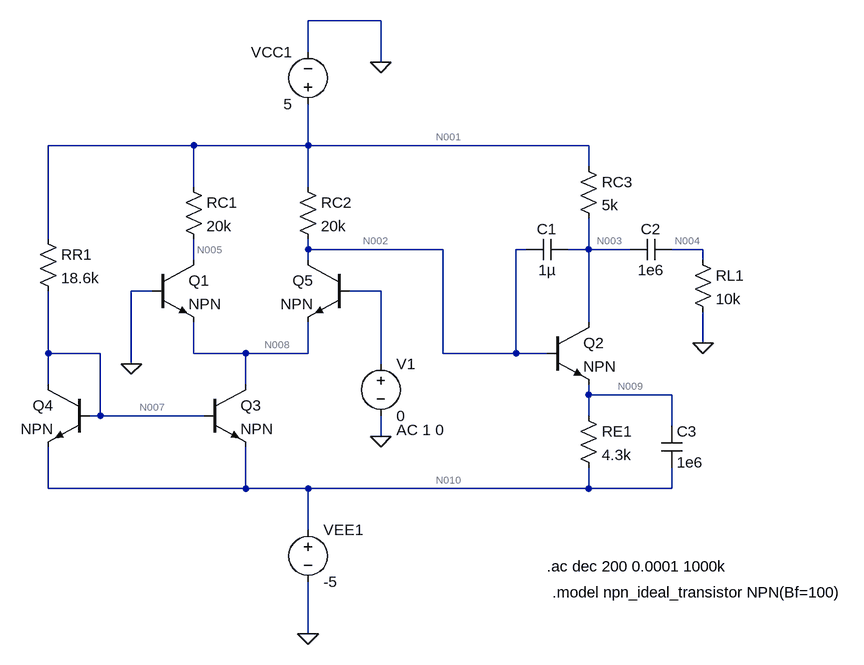
[diagram p0: schematic Circuit.asc]
Circuit.asc, the LTspice schematic file:
Version 4
SHEET 1 1496 1072
WIRE 688 112 576 112
WIRE 576 160 576 112
WIRE 688 176 688 112
WIRE 400 304 176 304
WIRE 576 304 576 240
WIRE 576 304 400 304
WIRE 1008 304 576 304
WIRE 1008 336 1008 304
WIRE 400 368 400 304
WIRE 576 368 576 304
WIRE 176 448 176 304
WIRE 576 464 576 448
WIRE 784 464 576 464
WIRE 912 464 896 464
WIRE 1008 464 1008 416
WIRE 1008 464 976 464
WIRE 1072 464 1008 464
WIRE 1184 464 1136 464
WIRE 400 480 400 448
WIRE 576 480 576 464
WIRE 1184 480 1184 464
WIRE 336 528 304 528
WIRE 688 528 640 528
WIRE 1008 576 1008 464
WIRE 1184 608 1184 560
WIRE 176 624 176 528
WIRE 256 624 176 624
WIRE 400 624 400 576
WIRE 480 624 400 624
WIRE 576 624 576 576
WIRE 576 624 480 624
WIRE 784 624 784 464
WIRE 896 624 896 464
WIRE 896 624 784 624
WIRE 944 624 896 624
WIRE 304 640 304 528
WIRE 688 640 688 528
WIRE 176 672 176 624
WIRE 480 672 480 624
WIRE 1008 688 1008 672
WIRE 1136 688 1008 688
WIRE 256 720 256 624
WIRE 256 720 240 720
WIRE 416 720 256 720
WIRE 1008 720 1008 688
WIRE 1136 736 1136 688
WIRE 688 752 688 720
WIRE 176 832 176 768
WIRE 480 832 480 768
WIRE 480 832 176 832
WIRE 576 832 480 832
WIRE 1008 832 1008 800
WIRE 1008 832 576 832
WIRE 1136 832 1136 800
WIRE 1136 832 1008 832
WIRE 576 896 576 832
WIRE 576 1056 576 976
FLAG 688 752 0
FLAG 1184 608 0
FLAG 576 1056 0
FLAG 688 176 0
FLAG 304 640 0
SYMBOL res 384 352 R0
SYMATTR InstName RC1
SYMATTR Value 20k
SYMBOL res 560 352 R0
SYMATTR InstName RC2
SYMATTR Value 20k
SYMBOL Res 992 704 R0
SYMATTR InstName RE1
SYMATTR Value 4.3k
SYMBOL Res 160 432 R0
SYMATTR InstName RR1
SYMATTR Value 18.6k
SYMBOL Res 992 320 R0
SYMATTR InstName RC3
SYMATTR Value 5k
SYMBOL npn 336 480 R0
SYMATTR InstName Q1
SYMBOL npn 944 576 R0
SYMATTR InstName Q2
SYMBOL npn 416 672 R0
SYMATTR InstName Q3
SYMBOL npn 240 672 M0
SYMATTR InstName Q4
SYMBOL npn 640 480 M0
SYMATTR InstName Q5
SYMBOL voltage 576 880 R0
SYMATTR InstName VEE1
SYMATTR Value -5
SYMBOL voltage 576 256 R180
WINDOW 0 24 96 Left 2
WINDOW 3 24 16 Left 2
SYMATTR InstName VCC1
SYMATTR Value 5
SYMBOL Res 1168 464 R0
SYMATTR InstName RL1
SYMATTR Value 10k
SYMBOL Voltage 688 624 R0
WINDOW 123 24 118 Left 2
SYMATTR InstName V1
SYMATTR Value 0
SYMATTR Value2 AC 1 0
SYMBOL cap 976 448 R90
WINDOW 0 0 32 VBottom 2
WINDOW 3 32 32 VTop 2
SYMATTR InstName C1
SYMATTR Value 1µ
SYMBOL cap 1136 448 R90
WINDOW 0 0 32 VBottom 2
WINDOW 3 32 32 VTop 2
SYMATTR InstName C2
SYMATTR Value 1e6
SYMBOL cap 1120 736 R0
SYMATTR InstName C3
SYMATTR Value 1e6
TEXT 944 952 Left 2 !.ac dec 200 0.0001 1000k
TEXT 952 992 Left 2 !.model npn_ideal_transistor NPN(Bf=100)

The netlist it stands for:
* Circuit.asc
RC1 N001 N005 20k
RC2 N001 N002 20k
RE1 N009 N010 4.3k
RR1 N001 N007 18.6k
RC3 N001 N003 5k
Q1 N005 0 N008 0 NPN
Q2 N003 N002 N009 0 NPN
Q3 N008 N007 N010 0 NPN
Q4 N007 N007 N010 0 NPN
Q5 N002 N006 N008 0 NPN
VEE1 N010 0 -5
VCC1 N001 0 5
RL1 N004 0 10k
V1 N006 0 0 AC 1 0
C1 N003 N002 1µ
C2 N004 N003 1e6
C3 N009 N010 1e6
.model NPN NPN
.model PNP PNP
.lib standard.bjt
.ac dec 200 0.0001 1000k
.model npn_ideal_transistor NPN(Bf=100)
.backanno
.end

* Results of the author's LTspice run, read from the files saved beside the schematic
* Operating Point, zero values left out:
*   V(n001) = 5 V
*   V(n005) = 175.6 mV
*   V(n002) = -18.98 mV
*   V(n009) = -792.5 mV
*   V(n010) = -5 V
*   V(n007) = -4.244 V
*   V(n003) = 134.5 mV
*   V(n008) = -737.5 mV
*   V(n004) = 1.332 mV
*   Ic(Q5) = 241.2 µA
*   Ib(Q5) = 2.412 µA
*   Ie(Q5) = -243.6 µA
*   Ic(Q4) = 487.3 µA
*   Ib(Q4) = 4.873 µA
*   Ie(Q4) = -492.1 µA
*   Ic(Q3) = 487.3 µA
*   Ib(Q3) = 4.873 µA
*   Ie(Q3) = -492.1 µA
*   Ic(Q2) = 973 µA
*   Ib(Q2) = 9.73 µA
*   Ie(Q2) = -982.7 µA
*   Ic(Q1) = 241.2 µA
*   Ib(Q1) = 2.412 µA
*   Ie(Q1) = -243.6 µA
*   I(C3) = 4.207 µA
*   I(C2) = -133.2 nA
*   I(Rl1) = 133.2 nA
*   I(Rc3) = 973.1 µA
*   I(Rr1) = 497 µA
*   I(Re1) = 978.5 µA
*   I(Rc2) = 250.9 µA
*   I(Rc1) = 241.2 µA
*   I(V1) = -2.412 µA
*   I(Vcc1) = -1.962 mA
*   I(Vee1) = 1.967 mA
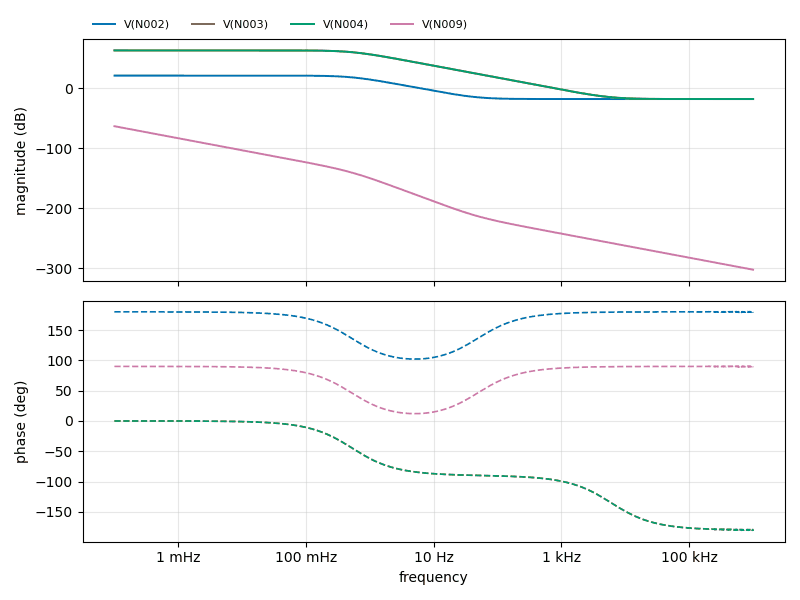
[diagram p1: AC Analysis of Circuit.asc, plotted from the saved traces]
* AC Analysis, 1 run:
*   V(N002): 20.78 dB at 100 µHz, -18.30 dB at 1 MHz, peak 20.78 dB at 100 µHz, 3 dB below the peak at 530.7 mHz
*   V(N003): 62.75 dB at 100 µHz, -18.30 dB at 1 MHz, peak 62.75 dB at 100 µHz, 3 dB below the peak at 530.7 mHz
*   V(N004): 62.75 dB at 100 µHz, -18.30 dB at 1 MHz, peak 62.75 dB at 100 µHz, 3 dB below the peak at 530.7 mHz
*   V(N009): -63.59 dB at 100 µHz, -302.67 dB at 1 MHz, peak -63.59 dB at 100 µHz, 3 dB below the peak at 141.4 µHz